# EAGLE schematic esp32_part_20190819 (EAGLE 9.4.2)
AUTHOR: iPAS

## Sheet 1 of 2
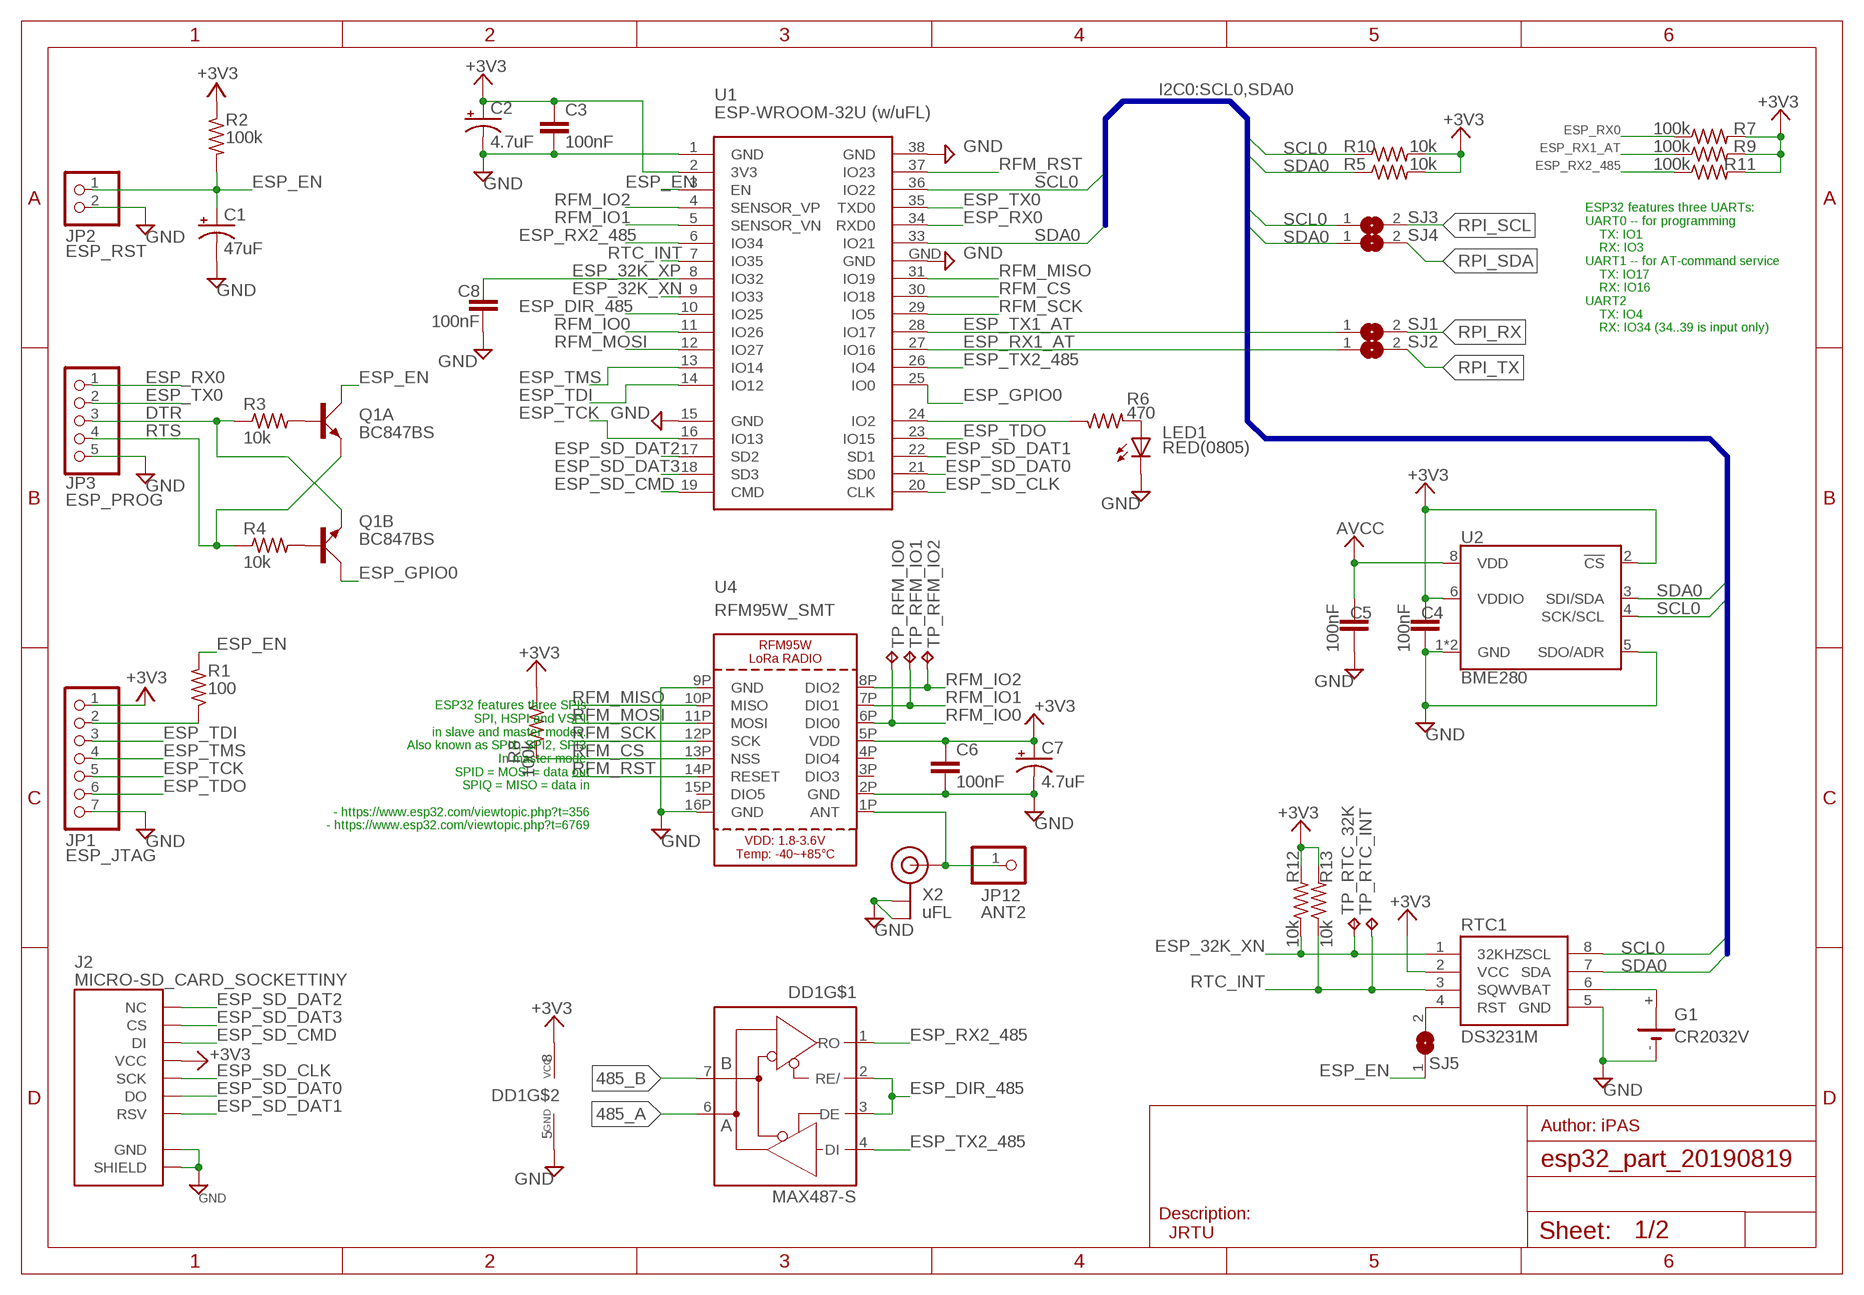
[diagram p0: schematic, sheet 1]

### Parts
C1  47uF  RCL_CPOL-US150CLZ-1014  [RCL_150CLZ-1014]
C2  4.7uF  RCL_CPOL-US150CLZ-1014  [RCL_150CLZ-1014]
C3  100nF  RCL_C-EUC1206  [RCL_C1206]
C4  100nF  RCL_C-EUC1206  [RCL_C1206]
C5  100nF  RCL_C-EUC1206  [RCL_C1206]
C6  100nF  RCL_C-EUC1206  [RCL_C1206]
C7  4.7uF  RCL_CPOL-US150CLZ-1014  [RCL_150CLZ-1014]
C8  100nF  RCL_C-EUC1206  [RCL_C1206]
DD1  MAX487-S  [SO08]
G1  CR2032V  [CR2032V]
J2  MICRO-SD_CARD_SOCKETTINY  [MICROSD_TINY]
JP1  ESP_JTAG  PINHD-1X7  [1X07]
JP2  ESP_RST  PINHD-1X2  [1X02]
JP3  ESP_PROG  PINHD-1X5  [1X05]
JP12  ANT2  HEADER-1X1ROUND  [1X01_ROUND]
LED1  RED(0805)  LEDCHIP-LED0805  [CHIP-LED0805]
Q1  BC847BS  [SOT363_PHILIPS]
R1  100  RCL_R-USM0805  [RCL_M0805]
R2  100k  RCL_R-USM0805  [RCL_M0805]
R3  10k  RCL_R-USM0805  [RCL_M0805]
R4  10k  RCL_R-USM0805  [RCL_M0805]
R5  10k  RCL_R-USM0805  [RCL_M0805]
R6  470  RCL_R-USM0805  [RCL_M0805]
R7  100k  RCL_R-USM0805  [RCL_M0805]
R8  100k  RCL_R-USM0805  [RCL_M0805]
R9  100k  RCL_R-USM0805  [RCL_M0805]
R10  10k  RCL_R-USM0805  [RCL_M0805]
R11  100k  RCL_R-USM0805  [RCL_M0805]
R12  10k  RCL_R-USM0805  [RCL_M0805]
R13  10k  RCL_R-USM0805  [RCL_M0805]
RTC1  DS3231M  [SO08]
SJ1  SOLDERJUMPERREFLOW  [SOLDERJUMPER_REFLOW]
SJ2  SOLDERJUMPERREFLOW  [SOLDERJUMPER_REFLOW]
SJ3  SOLDERJUMPERREFLOW  [SOLDERJUMPER_REFLOW]
SJ4  SOLDERJUMPERREFLOW  [SOLDERJUMPER_REFLOW]
SJ5  SOLDERJUMPERREFLOW  [SOLDERJUMPER_REFLOW]
TP_RFM_IO0  TPB1,27  [B1,27]
TP_RFM_IO1  TPB1,27  [B1,27]
TP_RFM_IO2  TPB1,27  [B1,27]
TP_RTC_32K  TPB1,27  [B1,27]
TP_RTC_INT  TPB1,27  [B1,27]
U1  ESP-WROOM-32U (w/uFL)  ESP-WROOM-32  [ESP-WROOM-32]
U2  BME280  [LGA-8-2.5X2.5]
U4  RFM95W_SMT  [RFMHCW_SMT]
X2  uFL  ANTENNA_U.FL  [U.FL]

### Nets
485_A: DD1.6(A)
485_B: DD1.7(B)
+3V3: C2.+ C3.1 C4.1 C6.1 C7.+ DD1.8(VCC) J2.4(VCC) JP1.1 R2.1 R5.2 R7.2 R8.1 R9.2 R10.2 R11.2 R12.2 R13.2 RTC1.2(VCC) U1.2(3V3) U2.2(!CS) U2.6(VDDIO) U4.5P(VDD) ; also sheet 2
ANT: JP12.1 U4.1P(ANT) X2.3(SIGNAL)
AVCC: C5.1 U2.8(VDD)
DTR: JP3.3 Q1.4(B:E) R3.1
ESP_32K_XN: R12.1 RTC1.1(32KHZ) TP_RTC_32K.TP U1.9(IO33)
ESP_32K_XP: C8.2 U1.8(IO32)
ESP_DIR_485: DD1.2(RE/) DD1.3(DE) U1.10(IO25)
ESP_EN: C1.+ JP2.1 Q1.6(A:C) R1.2 R2.2 SJ5.1 U1.3(EN)
ESP_GPIO0: Q1.3(B:C) U1.25(IO0)
ESP_RX0: JP3.1 R7.1 U1.34(RXD0)
ESP_RX1_AT: R9.1 SJ2.1 U1.27(IO16)
ESP_RX2_485: DD1.1(RO) R11.1 U1.6(IO34)
ESP_SD_CLK: J2.5(SCK) U1.20(CLK)
ESP_SD_CMD: J2.3(DI) U1.19(CMD)
ESP_SD_DAT0: J2.7(DO) U1.21(SD0)
ESP_SD_DAT1: J2.1(RSV) J2.8(RSV) U1.22(SD1)
ESP_SD_DAT2: J2.9(NC) U1.17(SD2)
ESP_SD_DAT3: J2.2(CS) U1.18(SD3)
ESP_TCK: JP1.5 U1.16(IO13)
ESP_TDI: JP1.3 U1.14(IO12)
ESP_TDO: JP1.6 U1.23(IO15)
ESP_TMS: JP1.4 U1.13(IO14)
ESP_TX0: JP3.2 U1.35(TXD0)
ESP_TX1_AT: SJ1.1 U1.28(IO17)
ESP_TX2_485: DD1.4(DI) U1.26(IO4)
GND: C1.- C2.- C3.2 C4.2 C5.2 C6.2 C7.- C8.1 DD1.5(GND) G1.- J2.6(GND) J2.GND1(SHIELD) J2.GND2(SHIELD) J2.GND3(SHIELD) J2.GND4(SHIELD) J2.GND5(SHIELD) J2.GND6(SHIELD) JP1.7 JP2.2 JP3.5 LED1.C RTC1.5(GND) U1.1(GND) U1.15(GND) U1.38(GND) U1.GND U2.1(GND) U2.5(SDO/ADR) U2.7(GND) U4.2P(GND) U4.9P(GND) U4.16P(GND) X2.1(GND) X2.2(GND) ; also sheet 2
N$1: LED1.A R6.2
N$2: R6.1 U1.24(IO2)
N$4: G1.+ RTC1.6(VBAT)
N$5: RTC1.4(RST) SJ5.2
N$13: Q1.2(A:B) R3.2
N$14: Q1.5(B:B) R4.2
N$16: JP1.2 R1.1
RFM_CS: R8.2 U1.30(IO18) U4.13P(NSS)
RFM_IO0: TP_RFM_IO0.TP U1.11(IO26) U4.6P(DIO0)
RFM_IO1: TP_RFM_IO1.TP U1.5(SENSOR_VN) U4.7P(DIO1)
RFM_IO2: TP_RFM_IO2.TP U1.4(SENSOR_VP) U4.8P(DIO2)
RFM_MISO: U1.31(IO19) U4.10P(MISO)
RFM_MOSI: U1.12(IO27) U4.11P(MOSI)
RFM_RST: U1.37(IO23) U4.14P(RESET)
RFM_SCK: U1.29(IO5) U4.12P(SCK)
RPI_RX: SJ1.2
RPI_SCL: SJ3.2
RPI_SDA: SJ4.2
RPI_TX: SJ2.2
RTC_INT: R13.1 RTC1.3(SQW) TP_RTC_INT.TP U1.7(IO35)
RTS: JP3.4 Q1.1(A:E) R4.1
SCL0: R10.1 RTC1.8(SCL) SJ3.1 U1.36(IO22) U2.4(SCK/SCL)
SDA0: R5.1 RTC1.7(SDA) SJ4.1 U1.33(IO21) U2.3(SDI/SDA)
Unconnected: G1.+@1(+) U4.3P(DIO3) U4.4P(DIO4) U4.15P(DIO5)

### Buses
I2C0:SCL0,SDA0

### Notes on the sheet
- ESP32 features three UARTs:
  UART0 -- for programming
      TX: IO1
      RX: IO3
  UART1 -- for AT-command service
      TX: IO17
      RX: IO16
  UART2
      TX: IO4
      RX: IO34 (34..39 is input only)
- ESP32 features three SPIs:
    SPI, HSPI and VSPI,
    in slave and master modes. 
  Also known as SPI1, SPI2, SPI3.
  In master mode;
    SPID = MOSI = data out
    SPIQ = MISO = data in
  
  - https://www.esp32.com/viewtopic.php?t=356
  - https://www.esp32.com/viewtopic.php?t=6769
- Author: iPAS
- Description:
    JRTU

## Sheet 2 of 2
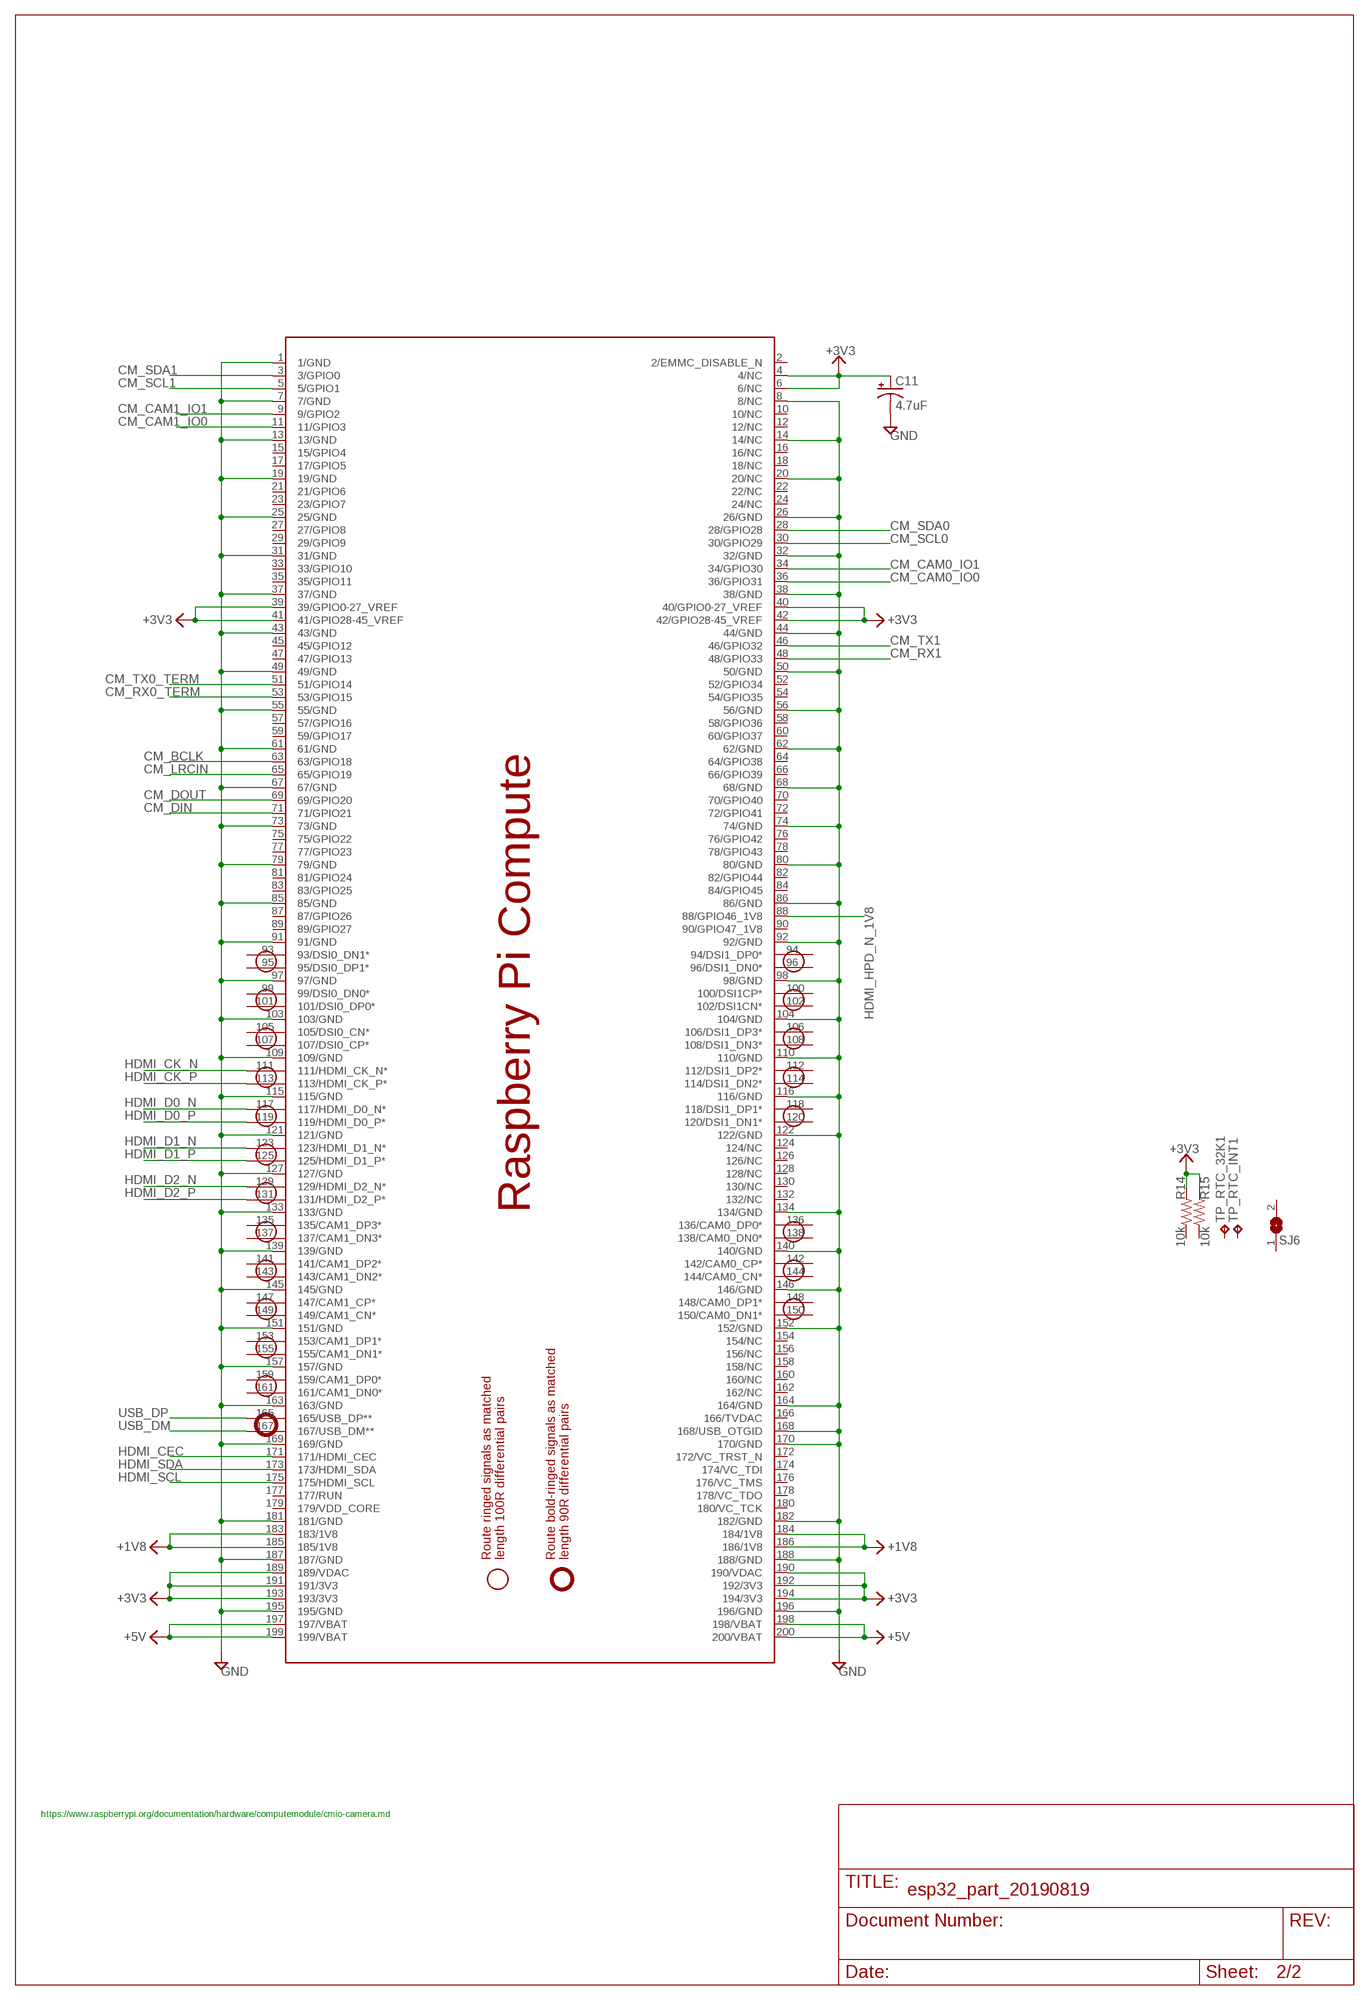
[diagram p1: schematic, sheet 2]

### Parts
C11  4.7uF  RCL_CPOL-US150CLZ-1014  [RCL_150CLZ-1014]
R14  10k  RCL_R-USM0805  [RCL_M0805]
R15  10k  RCL_R-USM0805  [RCL_M0805]
SJ6  SOLDERJUMPERREFLOW  [SOLDERJUMPER_REFLOW]
SODIMM  RPI_COMPUTE  [RPI_COMPUTE]
TP_RTC_32K1  TPB1,27  [B1,27]
TP_RTC_INT1  TPB1,27  [B1,27]

### Nets
+3V3: C11.+ R14.2 R15.2 SODIMM.4(4/NC) SODIMM.6(6/NC) SODIMM.39(39/GPIO0-27_VREF) SODIMM.40(40/GPIO0-27_VREF) SODIMM.41(41/GPIO28-45_VREF) SODIMM.42(42/GPIO28-45_VREF) SODIMM.183(183/1V8) SODIMM.184(184/1V8) SODIMM.185(185/1V8) SODIMM.186(186/1V8) SODIMM.189(189/VDAC) SODIMM.190(190/VDAC) SODIMM.191(191/3V3) SODIMM.192(192/3V3) SODIMM.193(193/3V3) SODIMM.194(194/3V3) ; supply symbol labelled +1V8 ; also sheet 1
+5V: SODIMM.197(197/VBAT) SODIMM.198(198/VBAT) SODIMM.199(199/VBAT) SODIMM.200(200/VBAT)
CM_BCLK: SODIMM.63(63/GPIO18)
CM_CAM0_IO0: SODIMM.36(36/GPIO31)
CM_CAM0_IO1: SODIMM.34(34/GPIO30)
CM_CAM1_IO0: SODIMM.11(11/GPIO3)
CM_CAM1_IO1: SODIMM.9(9/GPIO2)
CM_DIN: SODIMM.71(71/GPIO21)
CM_DOUT: SODIMM.69(69/GPIO20)
CM_LRCIN: SODIMM.65(65/GPIO19)
CM_RX0_TERM: SODIMM.53(53/GPIO15)
CM_RX1: SODIMM.48(48/GPIO33)
CM_SCL0: SODIMM.30(30/GPIO29)
CM_SCL1: SODIMM.5(5/GPIO1)
CM_SDA0: SODIMM.28(28/GPIO28)
CM_SDA1: SODIMM.3(3/GPIO0)
CM_TX0_TERM: SODIMM.51(51/GPIO14)
CM_TX1: SODIMM.46(46/GPIO32)
GND: C11.- SODIMM.1(1/GND) SODIMM.7(7/GND) SODIMM.8(8/NC) SODIMM.13(13/GND) SODIMM.14(14/NC) SODIMM.19(19/GND) SODIMM.20(20/NC) SODIMM.25(25/GND) SODIMM.26(26/GND) SODIMM.31(31/GND) SODIMM.32(32/GND) SODIMM.37(37/GND) SODIMM.38(38/GND) SODIMM.43(43/GND) SODIMM.44(44/GND) SODIMM.49(49/GND) SODIMM.50(50/GND) SODIMM.55(55/GND) SODIMM.56(56/GND) SODIMM.61(61/GND) SODIMM.62(62/GND) SODIMM.67(67/GND) SODIMM.68(68/GND) SODIMM.73(73/GND) SODIMM.74(74/GND) SODIMM.79(79/GND) SODIMM.80(80/GND) SODIMM.85(85/GND) SODIMM.86(86/GND) SODIMM.91(91/GND) SODIMM.92(92/GND) SODIMM.97(97/GND) SODIMM.98(98/GND) SODIMM.103(103/GND) SODIMM.104(104/GND) SODIMM.109(109/GND) SODIMM.110(110/GND) SODIMM.115(115/GND) SODIMM.116(116/GND) SODIMM.121(121/GND) SODIMM.122(122/GND) SODIMM.127(127/GND) SODIMM.133(133/GND) SODIMM.134(134/GND) SODIMM.139(139/GND) SODIMM.140(140/GND) SODIMM.145(145/GND) SODIMM.146(146/GND) SODIMM.151(151/GND) SODIMM.152(152/GND) SODIMM.157(157/GND) SODIMM.163(163/GND) SODIMM.164(164/GND) SODIMM.168(168/USB_OTGID) SODIMM.169(169/GND) SODIMM.170(170/GND) SODIMM.181(181/GND) SODIMM.182(182/GND) SODIMM.187(187/GND) SODIMM.188(188/GND) SODIMM.195(195/GND) SODIMM.196(196/GND) ; also sheet 1
HDMI_CEC: SODIMM.171(171/HDMI_CEC)
HDMI_CK_N: SODIMM.111(111/HDMI_CK_N*)
HDMI_CK_P: SODIMM.113(113/HDMI_CK_P*)
HDMI_D0_N: SODIMM.117(117/HDMI_D0_N*)
HDMI_D0_P: SODIMM.119(119/HDMI_D0_P*)
HDMI_D1_N: SODIMM.123(123/HDMI_D1_N*)
HDMI_D1_P: SODIMM.125(125/HDMI_D1_P*)
HDMI_D2_N: SODIMM.129(129/HDMI_D2_N*)
HDMI_D2_P: SODIMM.131(131/HDMI_D2_P*)
HDMI_HPD_N_1V8: SODIMM.88(88/GPIO46_1V8)
HDMI_SCL: SODIMM.175(175/HDMI_SCL)
HDMI_SDA: SODIMM.173(173/HDMI_SDA)
USB_DM: SODIMM.167(167/USB_DM**)
USB_DP: SODIMM.165(165/USB_DP**)
Unconnected: R14.1 R15.1 SJ6.1 SJ6.2 SODIMM.2(2/EMMC_DISABLE_N) SODIMM.10(10/NC) SODIMM.12(12/NC) SODIMM.15(15/GPIO4) SODIMM.16(16/NC) SODIMM.17(17/GPIO5) SODIMM.18(18/NC) SODIMM.21(21/GPIO6) SODIMM.22(22/NC) SODIMM.23(23/GPIO7) SODIMM.24(24/NC) SODIMM.27(27/GPIO8) SODIMM.29(29/GPIO9) SODIMM.33(33/GPIO10) SODIMM.35(35/GPIO11) SODIMM.45(45/GPIO12) SODIMM.47(47/GPIO13) SODIMM.52(52/GPIO34) SODIMM.54(54/GPIO35) SODIMM.57(57/GPIO16) SODIMM.58(58/GPIO36) SODIMM.59(59/GPIO17) SODIMM.60(60/GPIO37) SODIMM.64(64/GPIO38) SODIMM.66(66/GPIO39) SODIMM.70(70/GPIO40) SODIMM.72(72/GPIO41) SODIMM.75(75/GPIO22) SODIMM.76(76/GPIO42) SODIMM.77(77/GPIO23) SODIMM.78(78/GPIO43) SODIMM.81(81/GPIO24) SODIMM.82(82/GPIO44) SODIMM.83(83/GPIO25) SODIMM.84(84/GPIO45) SODIMM.87(87/GPIO26) SODIMM.89(89/GPIO27) SODIMM.90(90/GPIO47_1V8) SODIMM.93(93/DSI0_DN1*) SODIMM.94(94/DSI1_DP0*) SODIMM.95(95/DSI0_DP1*) SODIMM.96(96/DSI1_DN0*) SODIMM.99(99/DSI0_DN0*) SODIMM.100(100/DSI1CP*) SODIMM.101(101/DSI0_DP0*) SODIMM.102(102/DSI1CN*) SODIMM.105(105/DSI0_CN*) SODIMM.106(106/DSI1_DP3*) SODIMM.107(107/DSI0_CP*) SODIMM.108(108/DSI1_DN3*) SODIMM.112(112/DSI1_DP2*) SODIMM.114(114/DSI1_DN2*) SODIMM.118(118/DSI1_DP1*) SODIMM.120(120/DSI1_DN1*) SODIMM.124(124/NC) SODIMM.126(126/NC) SODIMM.128(128/NC) SODIMM.130(130/NC) SODIMM.132(132/NC) SODIMM.135(135/CAM1_DP3*) SODIMM.136(136/CAM0_DP0*) SODIMM.137(137/CAM1_DN3*) SODIMM.138(138/CAM0_DN0*) SODIMM.141(141/CAM1_DP2*) SODIMM.142(142/CAM0_CP*) SODIMM.143(143/CAM1_DN2*) SODIMM.144(144/CAM0_CN*) SODIMM.147(147/CAM1_CP*) SODIMM.148(148/CAM0_DP1*) SODIMM.149(149/CAM1_CN*) SODIMM.150(150/CAM0_DN1*) SODIMM.153(153/CAM1_DP1*) SODIMM.154(154/NC) SODIMM.155(155/CAM1_DN1*) SODIMM.156(156/NC) SODIMM.158(158/NC) SODIMM.159(159/CAM1_DP0*) SODIMM.160(160/NC) SODIMM.161(161/CAM1_DN0*) SODIMM.162(162/NC) SODIMM.166(166/TVDAC) SODIMM.172(172/VC_TRST_N) SODIMM.174(174/VC_TDI) SODIMM.176(176/VC_TMS) SODIMM.177(177/RUN) SODIMM.178(178/VC_TDO) SODIMM.179(179/VDD_CORE) SODIMM.180(180/VC_TCK) TP_RTC_32K1.TP TP_RTC_INT1.TP

### Notes on the sheet
- https://www.raspberrypi.org/documentation/hardware/computemodule/cmio-camera.md

## Library data of the parts
C1 C2 C7 C11 = ipas:RCL_CPOL-US: POLARIZED CAPACITOR, American symbol
C3-C6 C8 = ipas:RCL_C-EU: CAPACITOR, European symbol
DD1 = rs232-rs485:MAX487: RS485 TRANSEIVER
G1 = battery:CR2032V: LI BATTERY Varta
J2 = SparkFun-Connectors:MICRO-SD_CARD_SOCKET: microSD Socket for Transflash Push-push type µSD socket. tDoc lines correctly indicate media card edge positions when inserting (unlocked, locked, depressed). NOTE: CD1 and CD2 are connected internally, and the default detect state of the socket is detect pin to ground. SparkFun Products: WAV Trigger <https://www.sparkfun.com/products/13660> CAN-Bus Shield <https://www.sparkfun.com/products/13262> SparkFun Level Shifing microSD Breakout <https://www.sparkfun.com/products/13743>; PROD_ID: CONN-13500
JP1 = pinhead:PINHD-1X7: PIN HEADER
JP2 = pinhead:PINHD-1X2: PIN HEADER
JP3 = pinhead:PINHD-1X5: PIN HEADER
JP12 = microbuilder:HEADER-1X1: PIN HEADER
LED1 = led:LED: LED OSRAM: - CHIPLED LG R971, LG N971, LY N971, LG Q971, LY Q971, LO R971, LY R971 LH N974, LH R974 LS Q976, LO Q976, LY Q976 LO Q996 - Hyper CHIPLED LW Q18S LB Q993, LB Q99A, LB R99A - SideLED LS A670, LO A670, LY A670, LG A670, LP A670 LB A673, LV A673, LT A673, LW A673 LH A674 LY A675 LS A676, LA A676, LO A676, LY A676, LW A676 LS A679, LY A679, LG A679 - Hyper Micro SIDELED® LS Y876, LA Y876, LO Y876, LY Y876 LT Y87S - SmartLED LW L88C, LW L88S LB L89C, LB L89S, LG L890 LS L89K, LO L89K, LY L89K LS L896, LA L896, LO L896, LY L896 - TOPLED LS T670, LO T670, LY T670, LG T670, LP T670 LSG T670, LSP T670, LSY T670, LOP T670, LYG T670 LG T671, LOG T671, LSG T671 LB T673, LV T673, LT T673, LW T673 LH T674 LS T676, LA T676, LO T676, LY T676, LB T676, LH T676, LSB T676, LW T676 LB T67C, LV T67C, LT T67C, LS T67K, LO T67K, LY T67K, LW E67C LS E67B, LA E67B, LO E67B, LY E67B, LB E67C, LV E67C, LT E67C LW T67C LS T679, LY T679, LG T679 LS T770, LO T770, LY T770, LG T770, LP T770 LB T773, LV T773, LT T773, LW T773 LH T774 LS E675, LA E675, LY E675, LS T675 LS T776, LA T776, LO T776, LY T776, LB T776 LHGB T686 LT T68C, LB T68C - Hyper Mini TOPLED® LB M676 - Mini TOPLED Santana® LG M470 LS M47K, LO M47K, LY M47K Source: http://www.osram.convergy.de LUXEON: - LUMILED® LXK2-PW12-R00, LXK2-PW12-S00, LXK2-PW14-U00, LXK2-PW14-V00 LXK2-PM12-R00, LXK2-PM12-S00, LXK2-PM14-U00 LXK2-PE12-Q00, LXK2-PE12-R00, LXK2-PE12-S00, LXK2-PE14-T00, LXK2-PE14-U00 LXK2-PB12-K00, LXK2-PB12-L00, LXK2-PB12-M00, LXK2-PB14-N00, LXK2-PB14-P00, LXK2-PB14-Q00 LXK2-PR12-L00, LXK2-PR12-M00, LXK2-PR14-Q00, LXK2-PR14-R00 LXK2-PD12-Q00, LXK2-PD12-R00, LXK2-PD12-S00 LXK2-PH12-R00, LXK2-PH12-S00 LXK2-PL12-P00, LXK2-PL12-Q00, LXK2-PL12-R00 Source: www.luxeon.com KINGBRIGHT: KA-3528ASYC Source: www.kingbright.com
Q1 = transistor-small-signal:BC847BS: NPN general purpose double transistor Source: http://www.farnell.com/datasheets/2466.pdf
R1-R15 = ipas:RCL_R-US: RESISTOR, American symbol
RTC1 = SparkFun-Clocks:DS3231M: DS3231M Real Time Clock Accuracy +/-5ppm. Battery Backup. 2.3V to 5.5V. Datasheet <https://cdn.sparkfun.com/datasheets/Dev/Beagle/DS3231M.pdf> SparkFun Products CryptoCape <https://www.sparkfun.com/products/12773> (DEV-12773) SparkFun CryptoShield <https://www.sparkfun.com/products/13183> (DEV-13183); PROD_ID: IC-11985
SJ1-SJ6 = ipas:SOLDERJUMPER: SMD Solder JUMPER Solder the two pads together to create a connection, or remove the solder to break it. REFLOW - Use this footprint for solder paste and reflow ovens. WAVE - Use this footprint for hand-soldering (larger pads). CLOSED - Has a trace between the two pads to ensure it is closed by default. The trace needs to be cut to disable the jumper, and can be closed again by creating a solder bridge between the two pads.
SODIMM = e14_Rpi_Compute_RevC:RPI_COMPUTE: Device for a Raspberry PI Compute module. Note that the package is for a DDR2 connector of 'standard' orientation. Example: TE Connectivity P/N: 1565917-4, Newark P/N: 08P0616, Farnell P/N: 2112525 More information is available at http://www.element14.com/community/community/raspberry-pi/raspberry-pi-compute-module; CID: 356
TP_RFM_IO0 TP_RFM_IO1 TP_RFM_IO2 TP_RTC_32K TP_RTC_32K1 TP_RTC_INT TP_RTC_INT1 = ipas:TP: Test pad
U1 = esp32:ESP-WROOM-32: Espressif Systems ESP-WROOM-32
U2 = SparkFun-Sensors:BME280: Bosch BME280 – Combined Humidity and Pressure Sensor The BME280 is as combined digital humidity, pressure and temperature sensor based on proven sensing principles. The sensor module is housed in an extremely compact metal-lid LGA package with a footprint of only 2.5×2.5mm² with a height of 0.93mm. Its small dimensions and its low power consumption allow the implementation in battery driven devices such as handsets, GPS modules or watches. Datasheet <https://cdn.sparkfun.com/assets/learn_tutorials/4/1/9/BST-BME280_DS001-10.pdf> SparkFun Products SparkFun Atmospheric Sensor Breakout - BME280 <https://www.sparkfun.com/products/13676> (SEN-13676); PROD_ID: IC-13090
U4 = ipas:RFM95W: RFM69HCW - ISM Band RF Transceiver
X2 = microbuilder:ANTENNA_U.FL: U.FL Antenna Connector